# Altium project PoE_Injector_DownloadStation.PrjPcb (part 2 of 2)

## Sheet Mains.SchDoc
size A3; SheetNumber: 2; SheetTotal: 9
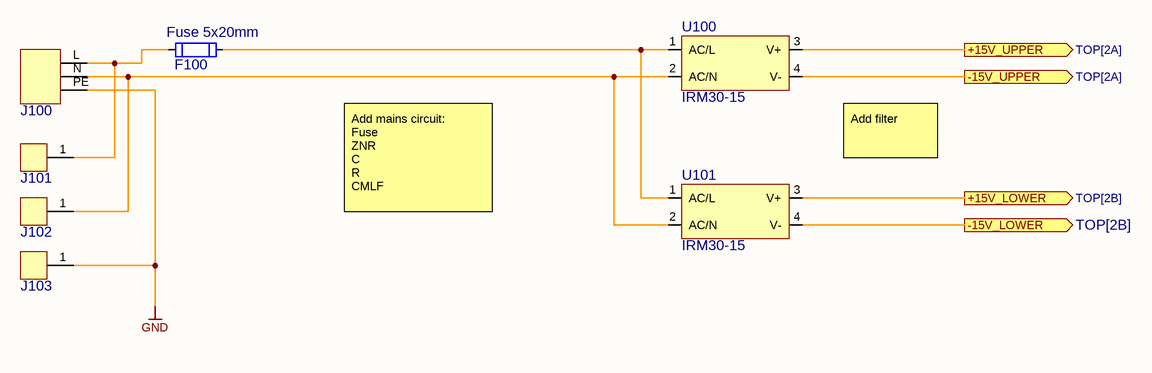
[diagram p5: Mains.SchDoc]

### Parts
F100  Fuse 5x20mm  [OGN_THR]
J100  GSP1.9203.1  [GSP1.9203.1]  (value not drawn)
J101  6.35mmx0.81mm Tab THT  [Tab_THT_635]  (value not drawn)
J102  6.35mmx0.81mm Tab THT  [Tab_THT_635]  (value not drawn)
J103  6.35mmx0.81mm Tab THT  [Tab_THT_635]  (value not drawn)
U100  IRM30-15  [IRM30]
U101  IRM30-15  [IRM30]

### Ports
+15V_LOWER (out, see TOP[2B]), +15V_UPPER (out, see TOP[2A]), -15V_LOWER (out, see TOP[2B]), -15V_UPPER (out, see TOP[2A])

### Nets
GND: J100.PE J103.1 U101.4(V-) ; port -15V_LOWER
GND_BAT: U100.4(V-) ; port -15V_UPPER
NetF100_1: F100.1 J100.L J101.1
NetF100_2: F100.2 U100.1(AC/L) U101.1(AC/L)
NetJ100_N: J100.N J102.1 U100.2(AC/N) U101.2(AC/N)
NetQ200_Charger_Lower_D: U101.3(V+) ; port +15V_LOWER
NetQ200_Charger_Upper_D: U100.3(V+) ; port +15V_UPPER

### Notes on the sheet
- Add filter
- Add mains circuit:
  Fuse
  ZNR
  C
  R
  CMLF
- Date:
- Size:
- A3
- Schema:
- Layout:

### Library data of the parts
F100 = Fuse/5x20mm/OGN: open fuse holder, 5 x 20 mm, THR, IEC 60335-1; Manufacturer: Schurter; Manufacturer Part Number 1: 3-132-873; Part Number: Fuse/5x20mm/OGN; Package: 5X20; HelpURL: https://www.schurter.com/en/datasheet/typ_OGN.pdf; Manufacturer 1: Schurter; Supplier 1: Digi-Key; Supplier Part Number 1: 486-3-132-873-ND
J100 = GSP1.9203.1: IEC Gerätestecker C14 oder C18, Schraubmontage, rückseitig, PCB-Anschlüsse; Manufacturer: Schurter; Part Number: GSP1.9203.1; HelpURL: https://www.schurter.com/de/datasheet/GSP1; Manufacturer 1: Schurter; Manufacturer Part Number 1: GSP1.9203.1; Supplier 1: Digi-Key; Supplier Part Number 1: 486-4820-ND
J101-J103 = Tab_025_THT: CONN QC TAB 0.250 SOLDER; Manufacturer: GENERIC; Manufacturer 1: TE Connectivity AMP Connectors; Manufacturer Part Number 1: 1217861-1; Part Number: Tab_025_THT; HelpURL: https://www.te.com/usa-en/product-1217861-1.datasheet.pdf; Supplier 1: Digi-Key; Supplier Part Number 1: A100452CT-ND; Manufacturer 3: TE Connectivity; Manufacturer Part Number 3: 1217861-1; Supplier 3: LCSC; Supplier Part Number 3: C428480
U100 U101 = IRM30-15: 30W AC-DC PCB-Mount Green Power Module; Part Number: IRM30-15; Package: Module; HelpURL: https://www.meanwell-web.com/content/files/pdfs/productPdfs/MW/IRM-30/IRM-30-spec.pdf

## Sheet Ethernet_Connector.SchDoc
size A3; SheetNumber: 6; SheetTotal: 9
Used 4 times, as channels Ethernet Channel 1, Ethernet Channel 2, Ethernet Channel 3, Ethernet Channel 4. Parts and nets are listed once, with the designators drawn on the sheet.
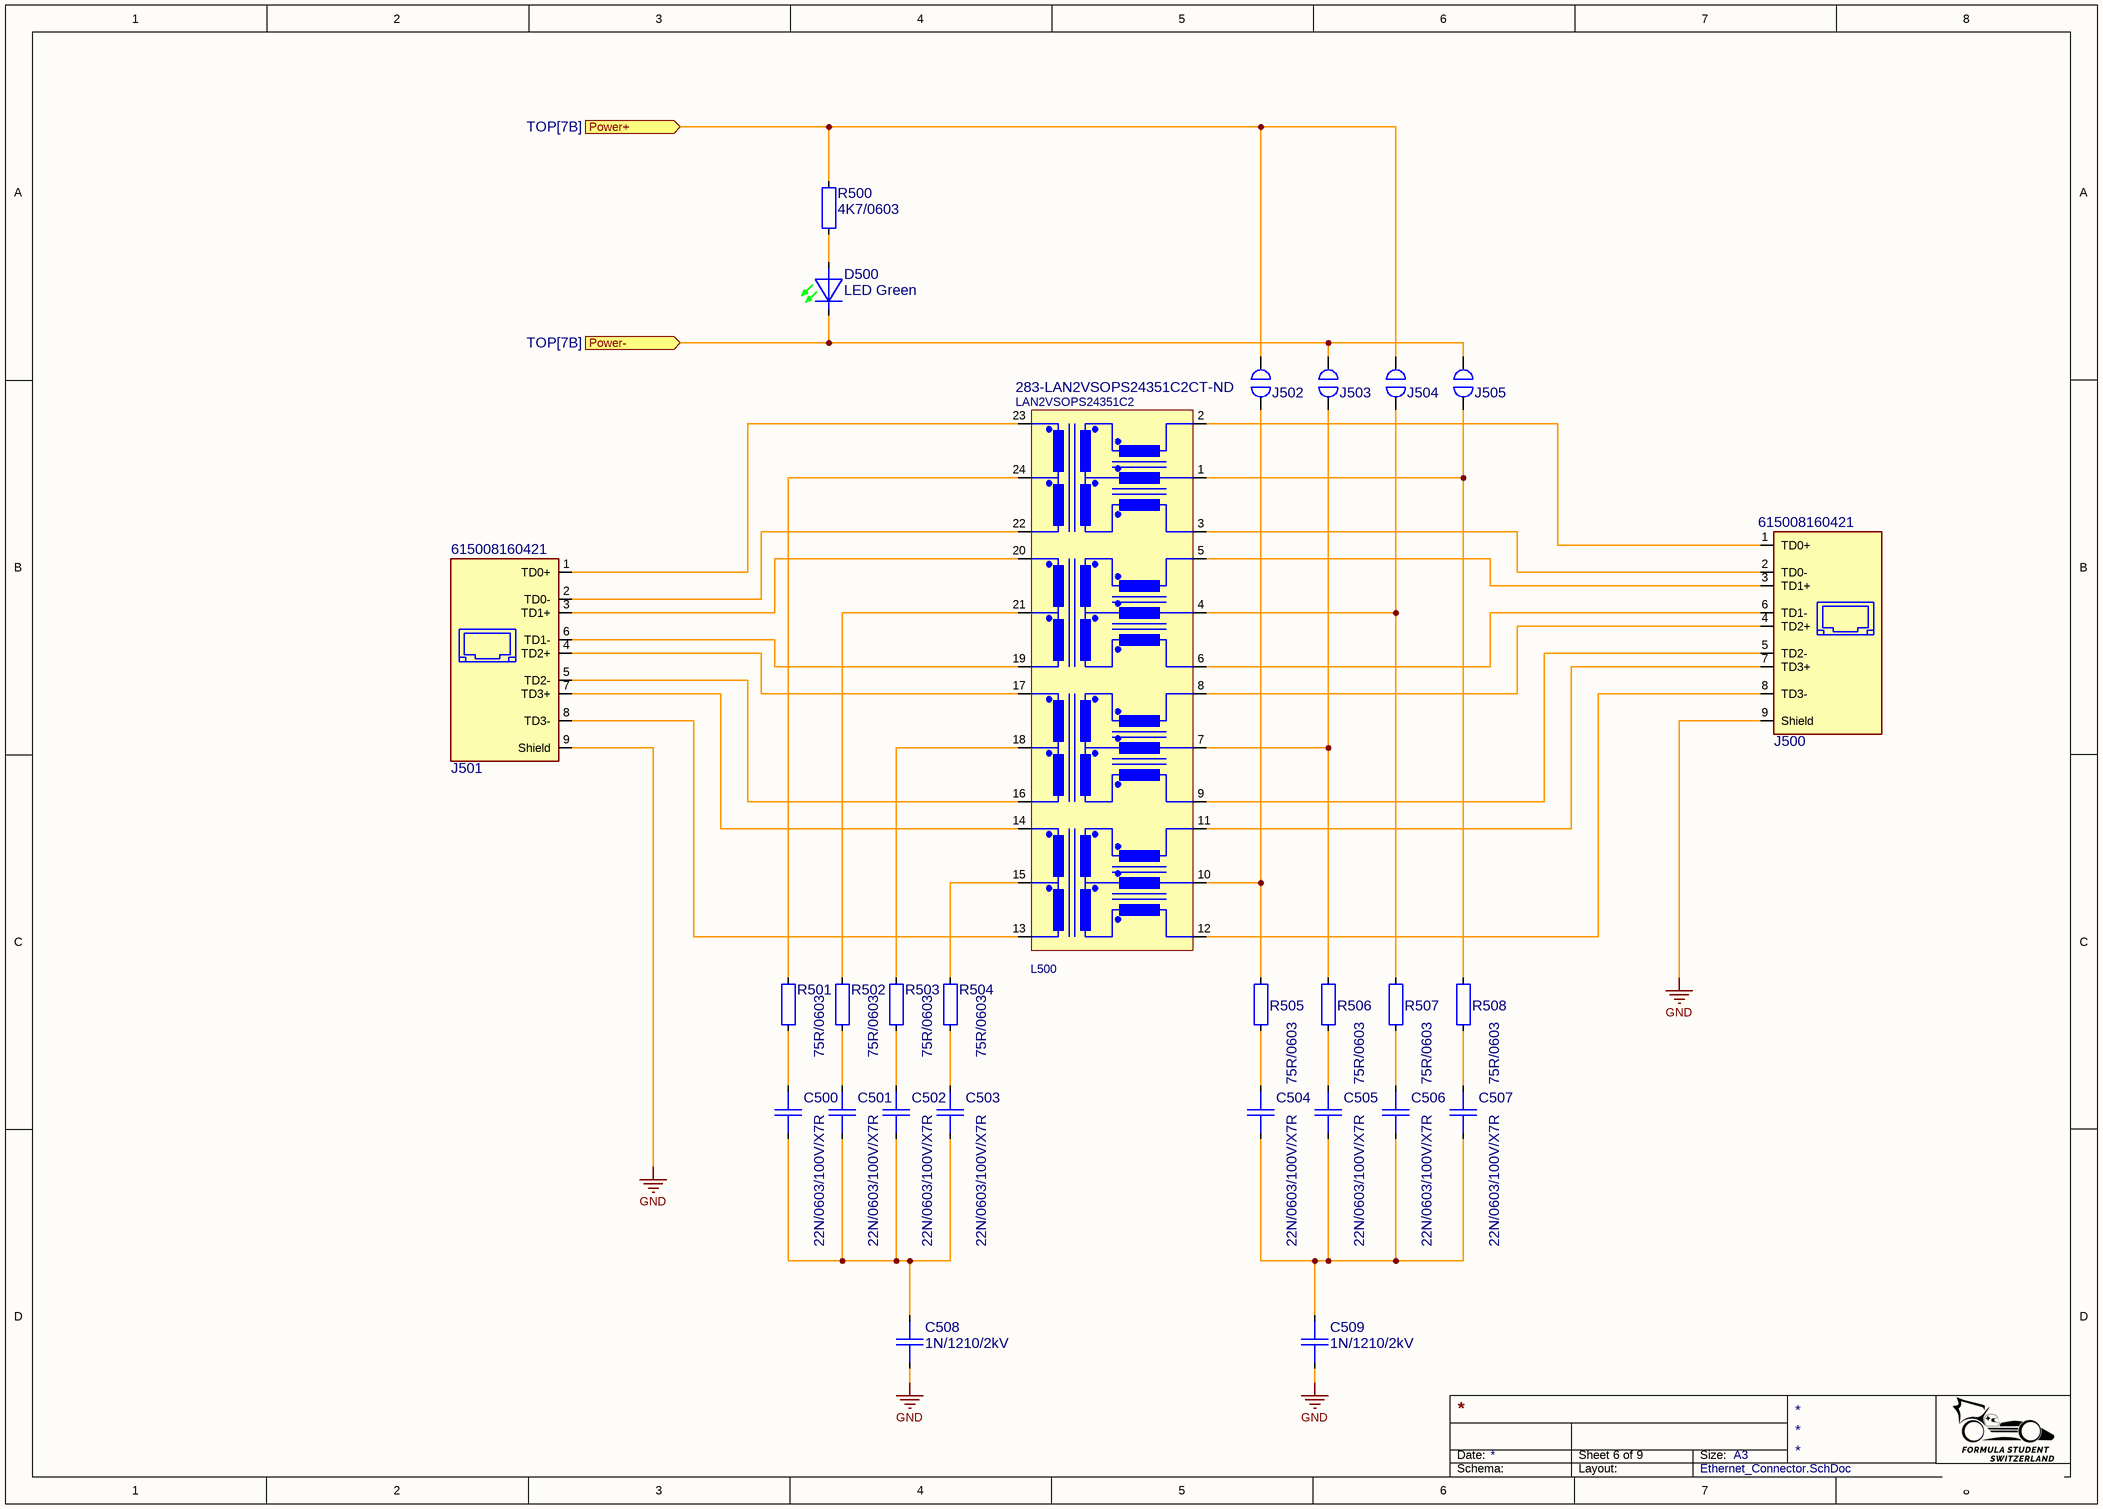
[diagram p6: Ethernet_Connector.SchDoc]

### Parts
C500  22N/0603/100V/X7R  [CAP0603_X7R]
C501  22N/0603/100V/X7R  [CAP0603_X7R]
C502  22N/0603/100V/X7R  [CAP0603_X7R]
C503  22N/0603/100V/X7R  [CAP0603_X7R]
C504  22N/0603/100V/X7R  [CAP0603_X7R]
C505  22N/0603/100V/X7R  [CAP0603_X7R]
C506  22N/0603/100V/X7R  [CAP0603_X7R]
C507  22N/0603/100V/X7R  [CAP0603_X7R]
C508  1N/1210/2kV  [CAP1210_X7R]
C509  1N/1210/2kV  [CAP1210_X7R]
D500  LED Green  [LED0603_GREEN]
J500  615008160421  [ETH_615008160421]
J501  615008160421  [ETH_615008160421]
J502  Solder Jumper 2pin 0.2mm small  [Solder_Jumper_2pin_0.2mm_small]  (value not drawn)
J503  Solder Jumper 2pin 0.2mm small  [Solder_Jumper_2pin_0.2mm_small]  (value not drawn)
J504  Solder Jumper 2pin 0.2mm small  [Solder_Jumper_2pin_0.2mm_small]  (value not drawn)
J505  Solder Jumper 2pin 0.2mm small  [Solder_Jumper_2pin_0.2mm_small]  (value not drawn)
L500  LAN2VSOPS24351C2  Supplier Part Number 1: 283-LAN2VSOPS24351C2CT-ND  [IND127P1600X620-24]
R500  4K7/0603  [R0603-0.40-WW]
R501  75R/0603  [R0603-0.40-WW]
R502  75R/0603  [R0603-0.40-WW]
R503  75R/0603  [R0603-0.40-WW]
R504  75R/0603  [R0603-0.40-WW]
R505  75R/0603  [R0603-0.40-WW]
R506  75R/0603  [R0603-0.40-WW]
R507  75R/0603  [R0603-0.40-WW]
R508  75R/0603  [R0603-0.40-WW]

### Ports
Power+ (in, see TOP[7B]), Power- (in, see TOP[7B])

### Nets
GND: C508.2 C509.2 J500.9(Shield) J501.9(Shield)
Power+: J502.1 J504.1 R500.2 ; port Power+
Power-: D500.1 J503.1 J505.1 ; port Power-
NetC500_1: C500.1 R501.2
NetC500_2: C500.2 C501.2 C502.2 C503.2 C508.1
NetC501_1: C501.1 R502.2
NetC502_1: C502.1 R503.2
NetC503_1: C503.1 R504.2
NetC504_1: C504.1 R505.2
NetC504_2: C504.2 C505.2 C506.2 C507.2 C509.1
NetC505_1: C505.1 R506.2
NetC506_1: C506.1 R507.2
NetC507_1: C507.1 R508.2
NetD500_2: D500.2 R500.1
NetJ500_1: J500.1(TD0+) L500.2
NetJ500_2: J500.2(TD0-) L500.3
NetJ500_3: J500.3(TD1+) L500.5
NetJ500_4: J500.4(TD2+) L500.8
NetJ500_5: J500.5(TD2-) L500.9
NetJ500_6: J500.6(TD1-) L500.6
NetJ500_7: J500.7(TD3+) L500.11
NetJ500_8: J500.8(TD3-) L500.12
NetJ501_1: J501.1(TD0+) L500.23
NetJ501_2: J501.2(TD0-) L500.22
NetJ501_3: J501.3(TD1+) L500.20
NetJ501_4: J501.4(TD2+) L500.17
NetJ501_5: J501.5(TD2-) L500.16
NetJ501_6: J501.6(TD1-) L500.19
NetJ501_7: J501.7(TD3+) L500.14
NetJ501_8: J501.8(TD3-) L500.13
NetJ502_2: J502.2 L500.10 R505.1
NetJ503_2: J503.2 L500.7 R506.1
NetJ504_2: J504.2 L500.4 R507.1
NetJ505_2: J505.2 L500.1 R508.1
NetL500_15: L500.15 R504.1
NetL500_18: L500.18 R503.1
NetL500_21: L500.21 R502.1
NetL500_24: L500.24 R501.1

### Channels
Ethernet Channel 1: designators end in _Ethernet_Channel_1; ports Power+=48V Power-=NetC402_2
Ethernet Channel 2: designators end in _Ethernet_Channel_2; ports Power+=48V Power-=NetC403_2
Ethernet Channel 3: designators end in _Ethernet_Channel_3; ports Power+=48V Power-=NetC405_2
Ethernet Channel 4: designators end in _Ethernet_Channel_4; ports Power+=48V Power-=NetC406_2

### Notes on the sheet
- Date:
- Size:
- A3
- Schema:
- Layout:

### Library data of the parts
C500-C507 = 22N/0603/100V/X7R: CAP SM 0603 22nF 100V X7R; Manufacturer: GENERIC; Manufacturer 1: KEMET; Manufacturer Part Number 1: C0603C223K1RAC7867; Absolute Value: 2.2E-8; Eurocircuits GPN: GPC0603223-100; Part Number: 22N/0603/100V/X7R; Package: 0603; Value: 22nF; HelpURL: https://connect.kemet.com:7667/gateway/IntelliData-ComponentDocumentation/1.0/download/datasheet/C0603C223K1RACTU; Supplier 1: Digi-Key; Supplier Part Number 1: 399-C0603C223K1RAC7867CT-ND; Manufacturer Part Number 3: 0603B223K101CT; Supplier 3: LCSC; Supplier Part Number 3: C388010
C508 C509 = 1N/1210/2kV: CAP SM 1210 1nF 2kV; Manufacturer: GENERIC; Manufacturer 1: Holy Stone Enterprise Co., Ltd.; Manufacturer Part Number 1: C1210X102K202T; Value: 1N; Absolute Value: 1E-9; Part Number: 1N/1210/2kV; Package: 1210; HelpURL: https://www.holystone.com.tw/downloads/series/10000/1000/45/20220530174254_file1.pdf; Supplier 1: Digi-Key; Supplier Part Number 1: 4587-C1210X102K202TCT-ND; Manufacturer Part Number 3: 1210B102K202NT; Supplier 3: LCSC; Supplier Part Number 3: C2836780
D500 = LED Green 0603: Generic LED Green 0603; Manufacturer 1: Würth; Manufacturer Part Number 1: 150060VS75000; Part Number: LED Green 0603; Manufacturer: GENERIC; Package: 603; Value: Green; Absolute Value: Green; HelpURL: https://www.we-online.com/katalog/datasheet/150060VS75000.pdf; Supplier 1: Digi-Key; Supplier Part Number 1: 732-4980-1-ND; Manufacturer 3: Everlight Elec; Manufacturer Part Number 3: 19-217/GHC-YR1S2/3T; Supplier 3: LCSC; Supplier Part Number 3: C72043; JLC Type: Basic
J500 J501 = ETH_THT_Vert_Schielded: CONN MOD JACK 8P8C VERT SHIELDED; Manufacturer: GENERIC; Manufacturer 1: Würth; Previous Identity: RJ45 Buchse, Gigabit Ethernet; Package Type: HALO/PBL HFJ11-1G41E-L12RL; Part Number: ETH_THT_Vert_Schielded; HelpURL: https://www.we-online.com/components/products/datasheet/615008160421.pdf; Manufacturer Part Number 1: 615008160421; Supplier 1: Digi-Key; Supplier Part Number 1: 732-615008160421-ND; Manufacturer 3: HCTL; Manufacturer Part Number 3: HC-RJ45-5224-1-4; Supplier 3: LCSC; Supplier Part Number 3: C3010560
J502-J505 = Solder_Jumper_2pin_0.2mm_small: Solder jumper with two pins with a spacing of 0.2mm; Manufacturer: NONE; Part Number: Solder_Jumper_2pin_0.2mm_small
L500 = LAN2VSOPS24351C2: 350µH LAN 1000 Base-T, Power over Ethernet (PoE) Pulswandler 1CT:1CT Oberflächenmontage; Manufacturer: Eaton; Part Number: LAN2VSOPS24351C2; HelpURL: https://www.eaton.com/content/dam/eaton/products/electronic-components/resources/data-sheet/eaton-lan2vsop-1000-base-t-lan-transformer-poe-data-sheet-elx1376-en.pdf; Manufacturer 1: Eaton; Manufacturer Part Number 1: LAN2VSOPS24351C2; Manufacturer 3: CND-tek; Manufacturer Part Number 3: G2412S; Supplier 3: LCSC; Supplier Part Number 3: C2912224; Supplier 1: DigiKey
R500 = 4K7/0603: RES SM 0603 4K7; Manufacturer: GENERIC; Manufacturer 1: YAGEO; Manufacturer Part Number 1: RC0603FR-134K7L; Absolute Value: 4700; Eurocircuits GPN: GPR06034K7; Part Number: 4K7/0603; Package: 0603; Value: 4K7; HelpURL: https://www.yageo.com/upload/media/product/app/datasheet/rchip/pyu-rc_group_51_rohs_l.pdf; Supplier 1: Digi-Key; Supplier Part Number 1: 13-RC0603FR-134K7LCT-ND; Manufacturer 2: YAGEO; Manufacturer Part Number 2: RC0603FR-104K7L; Supplier 2: Digi-Key; Supplier Part Number 2: 13-RC0603FR-104K7LCT-ND; Manufacturer 3: UNI-ROYAL(Uniroyal Elec); Manufacturer Part Number 3: 0603WAF4701T5E; Supplier 3: LCSC; Supplier Part Number 3: C23162; JLC Type: Basic
R501-R508 = 75R/0603: RES SM 0603 75R; Manufacturer: GENERIC; Manufacturer 1: YAGEO; Manufacturer Part Number 1: RC0603FR-1375RL; Absolute Value: 75; Eurocircuits GPN: GPR060375R; Part Number: 75R/0603; Package: 0603; Value: 75R; HelpURL: https://www.yageo.com/upload/media/product/productsearch/datasheet/rchip/PYu-RC_Group_51_RoHS_L_12.pdf; Supplier 1: Digi-Key; Supplier Part Number 1: 13-RC0603FR-1375RLCT-ND; Manufacturer 2: YAGEO; Manufacturer Part Number 2: RC0603FR-1075RL; Supplier 2: Digi-Key; Supplier Part Number 2: 13-RC0603FR-1075RLCT-ND; Supplier 3: LCSC; Supplier Part Number 3: C112309

## Sheet Interfaces.SchDoc
size A3; SheetNumber: 7; SheetTotal: 9
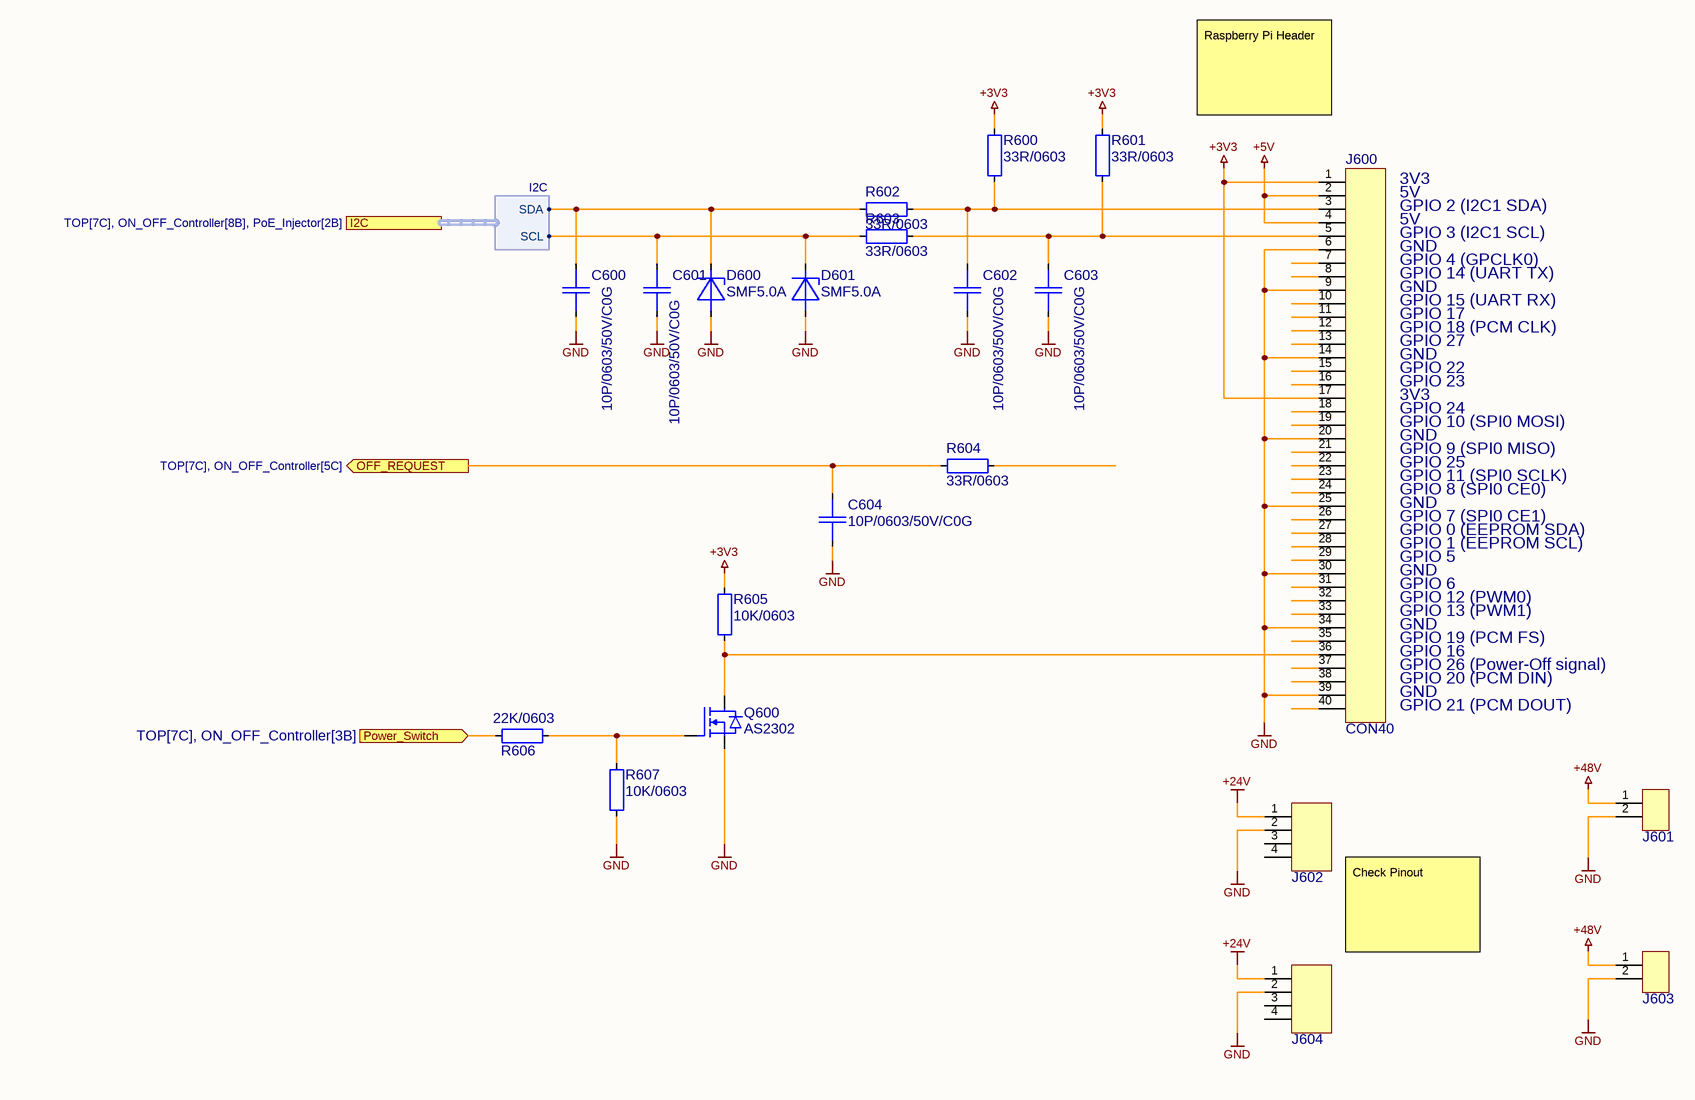
[diagram p7: Interfaces.SchDoc]

### Parts
C600  10P/0603/50V/C0G  [CAP0603_C0G]
C601  10P/0603/50V/C0G  [CAP0603_C0G]
C602  10P/0603/50V/C0G  [CAP0603_C0G]
C603  10P/0603/50V/C0G  [CAP0603_C0G]
C604  10P/0603/50V/C0G  [CAP0603_C0G]
D600  SMF5.0A  [SOD3720X110]
D601  SMF5.0A  [SOD3720X110]
J600  CON40  [HEAD_254_2X20]
J601  430450212  [430450212]  (value not drawn)
J602  430450412  [430450412]  (value not drawn)
J603  430450212  [430450212]  (value not drawn)
J604  430450412  [430450412]  (value not drawn)
Q600  AS2302  [SOT2395P280X125-3-SE]
R600  33R/0603  [R0603-0.40-WW]
R601  33R/0603  [R0603-0.40-WW]
R602  33R/0603  [R0603-0.40-WW]
R603  33R/0603  [R0603-0.40-WW]
R604  33R/0603  [R0603-0.40-WW]
R605  10K/0603  [R0603-0.40-WW]
R606  22K/0603  [R0603-0.40-WW]
R607  10K/0603  [R0603-0.40-WW]

### Ports
I2C (harness I2C, see TOP[7C], ON_OFF_Controller[8B], PoE_Injector[2B]), OFF_REQUEST (out, see TOP[7C], ON_OFF_Controller[5C]), Power_Switch (in, see TOP[7C], ON_OFF_Controller[3B])

### Harnesses
I2C: SDA, SCL

### Nets
+3V3: J600.1 J600.17 R600.2 R601.2 R605.1
+5V: J600.2 J600.4
+24V: J602.1 J604.1
+48V: J601.1 J603.1
GND: C600.2 C601.2 C602.2 C603.2 C604.2 D600.2 D601.2 J600.6 J600.9 J600.14 J600.20 J600.25 J600.30 J600.34 J600.39 J601.2 J602.2 J603.2 J604.2 Q600.2(SOURCE) R607.2
I2C.SCL: C601.1 D601.1 R603.1 ; port I2C.SCL
I2C.SDA: C600.1 D600.1 R602.1 ; port I2C.SDA
NetC602_1: C602.1 J600.3 R600.1 R602.2
NetC603_1: C603.1 J600.5 R601.1 R603.2
NetC604_1: C604.1 R604.1 ; port OFF_REQUEST
NetD800_2: R606.1 ; port Power_Switch
NetJ600_36: J600.36 Q600.3(DRAIN) R605.2
NetQ600_1: Q600.1(GATE) R606.2 R607.1

Not connected (* = marked no-connect by the designer): J600 7 8 10 11 12 13 15 16 18 19 21 22 23 24 26 27 28 29 31 32 33 35 37 38 40; J602 3 4; J604 3 4; R604 2

### Notes on the sheet
- Raspberry Pi Header
- 3V3
- 5V
- GPIO 2 (I2C1 SDA)
- GPIO 3 (I2C1 SCL)
- GND
- GPIO 4 (GPCLK0)
- GPIO 14 (UART TX)
- GPIO 15 (UART RX)
- GPIO 17
- GPIO 18 (PCM CLK)
- GPIO 27
- GPIO 22
- GPIO 23
- GPIO 24
- GPIO 10 (SPI0 MOSI)
- GPIO 9 (SPI0 MISO)
- GPIO 25
- GPIO 11 (SPI0 SCLK)
- GPIO 8 (SPI0 CE0)
- GPIO 7 (SPI0 CE1)
- GPIO 0 (EEPROM SDA)
- GPIO 1 (EEPROM SCL)
- GPIO 5
- GPIO 6
- GPIO 12 (PWM0)
- GPIO 13 (PWM1)
- GPIO 19 (PCM FS)
- GPIO 16
- GPIO 26 (Power-Off signal)
- GPIO 20 (PCM DIN)
- GPIO 21 (PCM DOUT)
- Check Pinout
- Date:
- Size:
- A3
- Schema:
- Layout:

### Library data of the parts
C600-C604 = 10P/0603/50V/C0G: CAP SM 0603 10pF 50V C0G; Manufacturer: GENERIC; Manufacturer 1: YAGEO; Manufacturer Part Number 1: CC0603JRNPO9BN100; Absolute Value: 1E-11; Eurocircuits GPN: GPC0603100-C0G; Part Number: 10P/0603/50V/C0G; Package: 0603; Value: 10pF; HelpURL: https://www.yageo.com/upload/media/product/productsearch/datasheet/mlcc/UPY-GP_NP0_16V-to-50V_18.pdf; Supplier 1: Digi-Key; Supplier Part Number 1: 311-1058-1-ND; Manufacturer 2: YAGEO; Manufacturer Part Number 2: CC0603KRNPO9BN100; Supplier 2: Digi-Key; Supplier Part Number 2: 311-4025-1-ND
D600 D601 = SMF5.0A: TVS DIODE 5VWM 9.2VC SOD123F; Manufacturer: Littelfuse Inc.; Manufacturer Part Number 1: SMF5.0A-T13; Absolute Value: 5V; Part Number: SMF5.0A; Package: SOD-123F; Value: SMF5.0A; HelpURL: https://www.littelfuse.com/~/media/electronics/datasheets/tvs_diodes/littelfuse_tvs_diode_smf_datasheet.pdf.pdf; Manufacturer 1: Littelfuse Inc.; Supplier 1: Digi-Key; Supplier Part Number 1: 18-SMF5.0A-T13CT-ND; Manufacturer 2: Littelfuse Inc.; Manufacturer Part Number 2: SMF5.0A; Supplier 2: Digi-Key; Supplier Part Number 2: F5748CT-ND; Manufacturer 3: MDD（Microdiode Electronics）; Manufacturer Part Number 3: SMF5.0A; Supplier 3: LCSC; Supplier Part Number 3: C193402; JLC Type: Extended
J600 = Header_2x20: Header 100 mil; Manufacturer: GENERIC; Part Number: Header_2x20
J601 J603 = Microfit_3.0_1x2_VERT_THT: Micro-Fit 3.0 Vertical Header, 3.00mm Pitch, Dual Row, 2 Circuits, with PCB Polarizing Peg, Tin, Glow-Wire Capable, Black; Manufacturer 1: Molex; Part Number: Microfit_3.0_1x2_VERT_THT; HelpURL: https://tools.molex.com/pdm_docs/ps/PS-43045.pdf; Manufacturer Part Number 1: 430450212; Supplier 1: Digi-Key; Supplier Part Number 1: WM1789-ND
J602 J604 = Microfit_3.0_2x2_VERT_THT: Micro-Fit 3.0 Vertical Header, 3.00mm Pitch, Dual Row, 4 Circuits, with PCB Polarizing Peg, Tin, Glow-Wire Capable, Black; Manufacturer 1: Molex; Part Number: Microfit_3.0_2x2_VERT_THT; HelpURL: https://tools.molex.com/pdm_docs/sd/430450412_sd.pdf; Manufacturer Part Number 1: 430450412; Supplier 1: Digi-Key; Supplier Part Number 1: WM1790-ND
Q600 = AS2302: N-Channel 20V(D-S) MOSFET; Manufacturer: GENERIC; Manufacturer 1: ANBON SEMICONDUCTOR (INT'L) LIMITED; Part Number: AS2302; Package: SOT23; HelpURL: https://datasheet.lcsc.com/lcsc/1809211431_AnBon-AS2302_C232266.pdf; Manufacturer Part Number 1: AS2302; Supplier 1: Digi-Key; Supplier Part Number 1: 4530-AS2302CT-ND; Manufacturer 3: AnBon; Manufacturer Part Number 3: AS2302; Supplier 3: LCSC; Supplier Part Number 3: C232266; JLC Type: Extended
R600-R604 = 33R/0603: RES SM 0603 33R; Manufacturer: GENERIC; Manufacturer 1: YAGEO; Manufacturer Part Number 1: RC0603FR-1333RL; Absolute Value: 33; Eurocircuits GPN: GPR060333R; Part Number: 33R/0603; Package: 0603; Value: 33R; HelpURL: https://www.yageo.com/upload/media/product/app/datasheet/rchip/pyu-rc_group_51_rohs_l.pdf; Supplier 1: Digi-Key; Supplier Part Number 1: 13-RC0603FR-1333RLCT-ND; Manufacturer 2: YAGEO; Manufacturer Part Number 2: RC0603FR-1033RL; Supplier 2: Digi-Key; Supplier Part Number 2: 13-RC0603FR-1033RLCT-ND
R605 R607 = 10K/0603: RES SM 0603 10K; Manufacturer: GENERIC; Manufacturer 1: YAGEO; Manufacturer Part Number 1: RC0603FR-1310KL; Absolute Value: 10000; Eurocircuits GPN: GPR060310K; Part Number: 10K/0603; Package: 0603; Value: 10K; HelpURL: https://www.yageo.com/upload/media/product/productsearch/datasheet/rchip/PYu-RC_Group_51_RoHS_L_12.pdf; Supplier 1: Digi-Key; Supplier Part Number 1: 13-RC0603FR-1310KLCT-ND; Manufacturer 2: YAGEO; Manufacturer Part Number 2: RC0603FR-1010KL; Supplier 2: Digi-Key; Supplier Part Number 2: 13-RC0603FR-1010KLCT-ND; Manufacturer 3: UNI-ROYAL(Uniroyal Elec); Manufacturer Part Number 3: 0603WAF1002T5E; Supplier 3: LCSC; Supplier Part Number 3: C25804; JLC Type: Basic
R606 = 22K/0603: RES SM 0603 22K; Manufacturer: GENERIC; Manufacturer 1: YAGEO; Manufacturer Part Number 1: RC0603FR-1322KL; Absolute Value: 22000; Eurocircuits GPN: GPR060322K; Part Number: 22K/0603; Package: 0603; Value: 22K; HelpURL: https://www.yageo.com/upload/media/product/app/datasheet/rchip/pyu-rc_group_51_rohs_l.pdf; Supplier 1: Digi-Key; Supplier Part Number 1: 13-RC0603FR-1322KLCT-ND; Manufacturer 2: YAGEO; Manufacturer Part Number 2: RC0603FR-1022KL; Supplier 2: Digi-Key; Supplier Part Number 2: 13-RC0603FR-1022KLCT-ND; Manufacturer 3: UNI-ROYAL(Uniroyal Elec); Manufacturer Part Number 3: 0603WAF2202T5E; Supplier 3: LCSC; Supplier Part Number 3: C31850; JLC Type: Basic

## Sheet RPI_Supply.SchDoc: RPI Supply
size A3; SheetNumber: 8; SheetTotal: 9
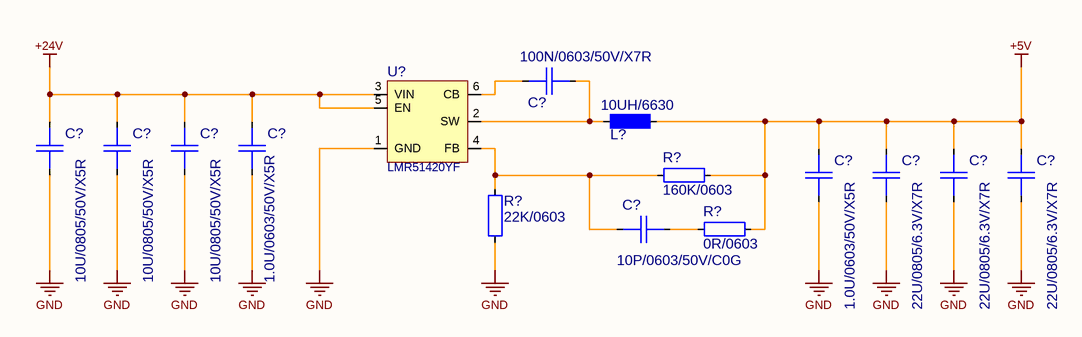
[diagram p8: RPI_Supply.SchDoc]

### Parts
(Parts that share a designator on the sheet are numbered #1, #2 ... from top to bottom, then left to right.)
C?#1  100N/0603/50V/X7R  [CAP0603_X7R]
C?#2  10U/0805/50V/X5R  [CAP0805_X7R]
C?#3  10U/0805/50V/X5R  [CAP0805_X7R]
C?#4  10U/0805/50V/X5R  [CAP0805_X7R]
C?#5  1.0U/0603/50V/X5R  [CAP0603_X7R]
C?#6  1.0U/0603/50V/X5R  [CAP0603_X7R]
C?#7  22U/0805/6.3V/X7R  [CAP0805_X7R]
C?#8  22U/0805/6.3V/X7R  [CAP0805_X7R]
C?#9  22U/0805/6.3V/X7R  [CAP0805_X7R]
C?#10  10P/0603/50V/C0G  [CAP0603_C0G]
L?  10UH/6630  [INDM660730X30]
R?#1  160K/0603  [R0603-0.40-WW]
R?#2  0R/0603  [R0603-0.40-WW]
R?#3  22K/0603  [R0603-0.40-WW]
U?  LMR51420YF  [SOT2395P280X125-6-NW]

### Nets
+5V: C?#6.1 C?#7.1 C?#8.1 C?#9.1 L?.2 R?#1.1 R?#2.2
+24V: C?#2.1 C?#3.1 C?#4.1 C?#5.1 U?.3(VIN) U?.5(EN)
GND: C?#2.2 C?#3.2 C?#4.2 C?#5.2 C?#6.2 C?#7.2 C?#8.2 C?#9.2 R?#3.1 U?.1(GND)
NetC?#1_1: C?#1.1 U?.6(CB)
NetC?#1_2: C?#1.2 L?.1 U?.2(SW)
NetC?#10_1: C?#10.1 R?#1.2 R?#3.2 U?.4(FB)
NetC?#10_2: C?#10.2 R?#2.1

### Notes on the sheet
- Date:
- Size:
- A3
- Schema:
- Layout:

### Library data of the parts
C?#1 = 100N/0603/50V/X7R: CAP SM 0603 100nF 50V X7R; Manufacturer: GENERIC; Manufacturer 1: YAGEO; Manufacturer Part Number 1: CC0603KPX7R9BB104; Absolute Value: 1E-7; Eurocircuits GPN: GPC0603104; Part Number: 100N/0603/50V/X7R; Package: 0603; Value: 100nF; HelpURL: https://www.yageo.com/upload/media/product/app/datasheet/mlcc/upy-gphc_x7r_6_3v-to-250v.pdf; Supplier 1: Digi-Key; Supplier Part Number 1: 311-3567-1-ND; Manufacturer 2: YAGEO; Manufacturer Part Number 2: CC0603MRX7R9BB104; Supplier 2: Digi-Key; Supplier Part Number 2: 311-4110-1-ND; Supplier 3: LCSC; Supplier Part Number 3: C14663; JLC Type: Basic
C?#2-C?#4 = 10U/0805/50V/X5R: CAP SM 0805 10uF 50V X5R; Manufacturer: GENERIC; Manufacturer 1: Murata Electronics; Manufacturer Part Number 1: GRM21BR61H106KE43K; Absolute Value: 1E-5; Eurocircuits GPN: GPN0805106-50-X5R; Part Number: 10U/0805/50V/X5R; Package: 0805; Value: 10uF; HelpURL: https://search.murata.co.jp/Ceramy/image/img/A01X/G101/ENG/GRM21BR61H106KE43-01A.pdf; Supplier 1: Digi-Key; Supplier Part Number 1: 490-GRM21BR61H106KE43KCT-ND; Manufacturer Part Number 3: GRM21BR61H106KE43L; Supplier 3: LCSC; Supplier Part Number 3: C440198; JLC Type: Basic
C?#5 C?#6 = 1.0U/0603/50V/X5R: CAP SM 0603 1.0uF 50V X5R; Manufacturer: GENERIC; Manufacturer 1: Samsung Electro-Mechanics; Manufacturer Part Number 1: CL10A105KB8NNNC; Absolute Value: 1E-6; Eurocircuits GPN: GPC0603105-X5R; Part Number: 1.0U/0603/50V/X5R; Package: 0603; Value: 1.0uF; HelpURL: https://mm.digikey.com/Volume0/opasdata/d220001/medias/docus/658/CL10A105KB8NNNC_Spec.pdf; Supplier 1: Digi-Key; Supplier Part Number 1: 1276-1860-1-ND; Manufacturer Part Number 3: CL10A105KB8NNNC; Supplier 3: LCSC; Supplier Part Number 3: C15849; JLC Type: Basic
C?#7-C?#9 = 22U/0805/6.3V/X7R: CAP SM 0805 22uF 6.3V X7R; Manufacturer: GENERIC; Manufacturer 1: Murata; Manufacturer Part Number 1: GRM21BZ71A226ME15L; Absolute Value: 2.2E-5; Eurocircuits GPN: GPN0805226-6.3; Part Number: 22U/0805/6.3V/X7R; Package: 0805; Value: 22uF; HelpURL: https://search.murata.co.jp/Ceramy/image/img/A01X/G101/ENG/GRM21BZ71A226ME15-01.pdf; Supplier 1: Digi-Key; Supplier Part Number 1: 490-GRM21BZ71A226ME15LCT-ND; Manufacturer 2: Murata; Manufacturer Part Number 2: GRM21BZ70J226ME44L; Supplier 2: Digi-Key; Supplier Part Number 2: 490-GRM21BZ70J226ME44LCT-ND
C?#10 = 10P/0603/50V/C0G: as C600 on sheet Interfaces; Part Number: 10P/0603/50V/C0G; Package: 0603; Value: 10pF; HelpURL: https://www.yageo.com/upload/media/product/productsearch/datasheet/mlcc/UPY-GP_NP0_16V-to-50V_18.pdf; Supplier 1: Digi-Key; Supplier Part Number 1: 311-1058-1-ND; Manufacturer 2: YAGEO; Manufacturer Part Number 2: CC0603KRNPO9BN100; Supplier 2: Digi-Key; Supplier Part Number 2: 311-4025-1-ND
L? = 10UH/6630: FIXED IND 10UH 4A 68 MOHM SMD; Manufacturer: GENERIC; Manufacturer 1: Pulse Electronics; Manufacturer Part Number 1: BMRB00060630100MA1; Absolute Value: 1E-5; Part Number: 10UH/6630; Package: 6030 Inductor; Value: 10UH; HelpURL: https://productfinder.pulseelectronics.com/api/open/part-attachments/datasheet/BMRB00060630100MA1; Supplier 1: Digi-Key; Supplier Part Number 1: 553-BMRB00060630100MA1CT-ND; Manufacturer 3: Chilisin Elec; Manufacturer Part Number 3: BMRB00060630100MA1; Supplier 3: LCSC; Supplier Part Number 3: C5201679
R?#1 = 160K/0603: RES SM 0603 160K; Manufacturer: GENERIC; Manufacturer 1: YAGEO; Manufacturer Part Number 1: RC0603FR-13160KL; Absolute Value: 160000; Eurocircuits GPN: GPR0603160K; Part Number: 160K/0603; Package: 0603; Value: 160K; HelpURL: https://www.yageo.com/upload/media/product/productsearch/datasheet/rchip/PYu-RC_Group_51_RoHS_L_12.pdf; Supplier 1: Digi-Key; Supplier Part Number 1: 13-RC0603FR-13160KLCT-ND; Manufacturer 2: YAGEO; Manufacturer Part Number 2: RC0603FR-07160KL; Supplier 2: Digi-Key; Supplier Part Number 2: 311-160KHRCT-ND
R?#2 = 0R/0603: RES SM 0603 0R; Manufacturer: GENERIC; Manufacturer 1: YAGEO; Manufacturer Part Number 1: RC0603FR-070RL; Absolute Value: 0; Eurocircuits GPN: GPR06030R; Part Number: 0R/0603; Package: 0603; Value: 0R; HelpURL: https://www.yageo.com/upload/media/product/app/datasheet/rchip/pyu-rc_group_51_rohs_l.pdf; Supplier 1: Digi-Key; Supplier Part Number 1: 311-0.0HRCT-ND; Manufacturer 2: YAGEO; Manufacturer Part Number 2: RC0603FR-130RL; Supplier 2: Digi-Key; Supplier Part Number 2: 13-RC0603FR-130RLCT-ND; Manufacturer 3: UNI-ROYAL(Uniroyal Elec); Manufacturer Part Number 3: 0603WAF0000T5E; Supplier 3: LCSC; Supplier Part Number 3: C21189; JLC Type: Basic
R?#3 = 22K/0603: as R606 on sheet Interfaces; Part Number: 22K/0603; Package: 0603; Value: 22K; HelpURL: https://www.yageo.com/upload/media/product/app/datasheet/rchip/pyu-rc_group_51_rohs_l.pdf; Supplier 1: Digi-Key; Supplier Part Number 1: 13-RC0603FR-1322KLCT-ND; Manufacturer 2: YAGEO; Manufacturer Part Number 2: RC0603FR-1022KL; Supplier 2: Digi-Key; Supplier Part Number 2: 13-RC0603FR-1022KLCT-ND; Manufacturer 3: UNI-ROYAL(Uniroyal Elec); Manufacturer Part Number 3: 0603WAF2202T5E; Supplier 3: LCSC; Supplier Part Number 3: C31850; JLC Type: Basic
U? = LMR51420YF: SIMPLE SWITCHER® power converter 4.5-V to 36-V, 2-A, synchronous buck with 40-µA IQ; Manufacturer: Texas Instruments; Manufacturer Part Number 1: LMR51420YFDDCR; Part Number: LMR51420YF; Package: SOIC-8; HelpURL: https://www.ti.com/lit/ds/symlink/lmr51420.pdf; Manufacturer 1: Texas Instruments; Supplier 1: Digi-Key; Supplier Part Number 1: 296-LMR51420YFDDCRCT-ND; Manufacturer 3: Texas Instruments; Manufacturer Part Number 3: LMR51420YFDDCR; Supplier 3: LCSC; Supplier Part Number 3: C7296200

## Sheet ON_OFF_Controller.SchDoc
size A3; SheetNumber: 9; SheetTotal: 9
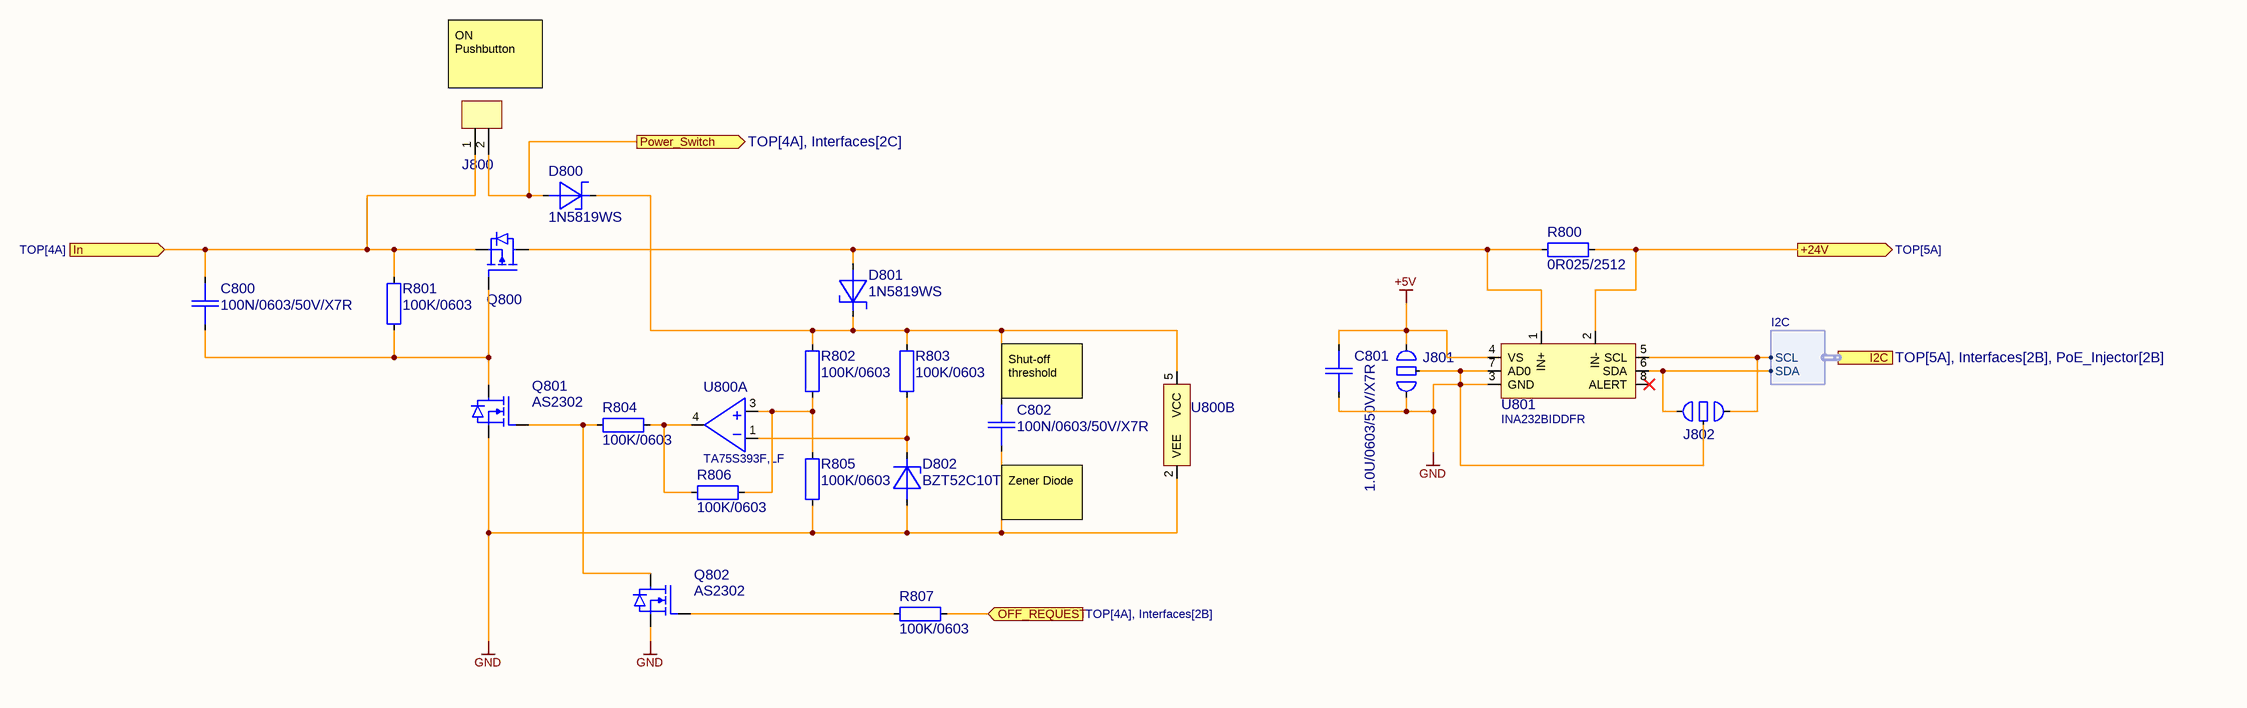
[diagram p9: ON_OFF_Controller.SchDoc]

### Parts
C800  100N/0603/50V/X7R  [CAP0603_X7R]
C801  1.0U/0603/50V/X7R  [CAP0603_X7R]
C802  100N/0603/50V/X7R  [CAP0603_X7R]
D800  1N5819WS  [SOD2513X100]
D801  1N5819WS  [SOD2513X100]
D802  BZT52C10T  [SOD1608X065]
J800  430450212  [430450212]  (value not drawn)
J801  Solder Jumper 3pin 0.2mm  [Solder_Jumper_3pin_0.2mm]  (value not drawn)
J802  Solder Jumper 3pin 0.2mm  [Solder_Jumper_3pin_0.2mm]  (value not drawn)
Q800  MCG35P04-TP  [SON065P330X330X075-5-TH245X175]  (value not drawn)
Q801  AS2302  [SOT2395P280X125-3-SE]
Q802  AS2302  [SOT2395P280X125-3-SE]
R800  0R025/2512  [R2512-0.65-WW]
R801  100K/0603  [R0603-0.40-WW]
R802  100K/0603  [R0603-0.40-WW]
R803  100K/0603  [R0603-0.40-WW]
R804  100K/0603  [R0603-0.40-WW]
R805  100K/0603  [R0603-0.40-WW]
R806  100K/0603  [R0603-0.40-WW]
R807  100K/0603  [R0603-0.40-WW]
U800  TA75S393F,LF  [SOT2395P280X125-5-SW]  (parts A,B of 2)
U801  INA232BIDDFR  [SOT065P280X110-8-SE]

### Ports
+24V (out, see TOP[5A]), I2C (harness I2C, see TOP[5A], Interfaces[2B], PoE_Injector[2B]), In (in, see TOP[4A]), OFF_REQUEST (in, see TOP[4A], Interfaces[2B]), Power_Switch (out, see TOP[4A], Interfaces[2C])

### Harnesses
I2C: SDA, SCL

### Nets
+5V: C801.1 J801.3 U801.4(VS)
+24V: R800.2 U801.2(IN-) ; port +24V
GND: C801.2 C802.2 D802.2 J801.1 J801.2 J802.2 Q801.2(SOURCE) Q802.2(SOURCE) R805.2 U800.2(VEE) U801.3(GND) U801.7(AD0)
I2C.SCL: J802.3 U801.5(SCL) ; port I2C.SCL
I2C.SDA: J802.1 U801.6(SDA) ; port I2C.SDA
NetC200_Charger_Upper_1: C800.1 J800.1 Q800.S(SOURCE) R801.1 ; port In
NetC604_1: R807.1 ; port OFF_REQUEST
NetC800_2: C800.2 Q800.G(GATE) Q801.3(DRAIN) R801.2
NetC802_1: C802.1 D800.1 D801.1 R802.1 R803.1 U800.5(VCC)
NetD800_2: D800.2 J800.2 ; port Power_Switch
NetD801_2: D801.2 Q800.D(DRAIN) R800.1 U801.1(IN+)
NetD802_1: D802.1 R803.2 U800.1(IN-)
NetQ801_1: Q801.1(GATE) Q802.3(DRAIN) R804.1
NetQ802_1: Q802.1(GATE) R807.2
NetR802_2: R802.2 R805.1 R806.1 U800.3(IN+)
NetR804_2: R804.2 R806.2 U800.4(OUT)

Not connected (* = marked no-connect by the designer): U801 8(ALERT)*

### Notes on the sheet
- (near J800) ON Pushbutton
- (near C802) Shut-off threshold
- (near C802) Zener Diode
- Date:
- Size:
- A3
- Schema:
- Layout:

### Library data of the parts
C800 C802 = 100N/0603/50V/X7R: as C?#1 on sheet RPI_Supply; Part Number: 100N/0603/50V/X7R; Package: 0603; Value: 100nF; HelpURL: https://www.yageo.com/upload/media/product/app/datasheet/mlcc/upy-gphc_x7r_6_3v-to-250v.pdf; Supplier 1: Digi-Key; Supplier Part Number 1: 311-3567-1-ND; Manufacturer 2: YAGEO; Manufacturer Part Number 2: CC0603MRX7R9BB104; Supplier 2: Digi-Key; Supplier Part Number 2: 311-4110-1-ND; Supplier 3: LCSC; Supplier Part Number 3: C14663; JLC Type: Basic
C801 = 1.0U/0603/50V/X7R: CAP SM 0603 1.0uF 50V X7R; Manufacturer: GENERIC; Manufacturer 1: YAGEO; Manufacturer Part Number 1: CC0603KRX7R9BB105; Absolute Value: 1E-6; Eurocircuits GPN: GPC0603105; Part Number: 1.0U/0603/50V/X7R; Package: 0603; Value: 1.0uF; HelpURL: https://www.yageo.com/upload/media/product/app/datasheet/mlcc/upy-gphc_x7r_6_3v-to-250v.pdf; Supplier 1: Digi-Key; Supplier Part Number 1: 311-2082-1-ND
D800 D801 = 1N5819WS: 40V 600mV@1A 1A SOD-323 Schottky Barrier Diodes (SBD) ROHS; Manufacturer: GENERIC; Part Number: 1N5819WS; Package: SOD323; Value: 1N5819WS; Absolute Value: 40V; HelpURL: https://datasheet.lcsc.com/lcsc/2204281430_Guangdong-Hottech-1N5819WS_C191023.pdf; Manufacturer 3: Guangdong Hottech; Manufacturer Part Number 3: 1N5819WS; Supplier 3: LCSC; Supplier Part Number 3: C191023; JLC Type: Basic
D802 = BZT52C10T: DIODE ZENER 10V 100MW SOD523; Manufacturer: Micro Commercial Co; Manufacturer Part Number 1: BZT52C10T-TP; Part Number: BZT52C10T; Package: SC-79, SOD-523; Value: BZT52C10T; Absolute Value: 10 V; HelpURL: https://www.mccsemi.com/pdf/Products/BZT52C(B)2V4T-BZT52C(B)39T(SOD-523).pdf; Manufacturer 1: Micro Commercial Co; Supplier 1: Digi-Key; Supplier Part Number 1: 353-BZT52C10T-TPCT-ND; Manufacturer 2: Diodes Incorporated; Manufacturer Part Number 2: BZT52C10T-7; Supplier 2: Digi-Key; Supplier Part Number 2: BZT52C10T-7DICT-ND
J800 = Microfit_3.0_1x2_VERT_THT: as J601 on sheet Interfaces; Part Number: Microfit_3.0_1x2_VERT_THT; HelpURL: https://tools.molex.com/pdm_docs/ps/PS-43045.pdf; Manufacturer Part Number 1: 430450212; Supplier 1: Digi-Key; Supplier Part Number 1: WM1789-ND
J801 J802 = Solder_Jumper_3pin_0.2mm: Solder jumper with three pins with a spacing of 0.2mm; Manufacturer: NONE; Part Number: Solder_Jumper_3pin_0.2mm
Q800 = MCG35P04-TP: 40V 35A P-Channel MOSFET; Manufacturer: Micro Commercial Co; Manufacturer Part Number 1: 353-MCG35P04-TPCT-ND; Part Number: MCG35P04-TP; HelpURL: https://www.mccsemi.com/pdf/Products/MCG35P04(DFN3333).pdf; Manufacturer 1: Micro Commercial Co; Supplier 1: Digi-Key; Supplier Part Number 1: 353-MCG35P04-TPCT-ND
Q801 Q802 = AS2302: as Q600 on sheet Interfaces; Part Number: AS2302; Package: SOT23; HelpURL: https://datasheet.lcsc.com/lcsc/1809211431_AnBon-AS2302_C232266.pdf; Manufacturer Part Number 1: AS2302; Supplier 1: Digi-Key; Supplier Part Number 1: 4530-AS2302CT-ND; Manufacturer 3: AnBon; Manufacturer Part Number 3: AS2302; Supplier 3: LCSC; Supplier Part Number 3: C232266; JLC Type: Extended
R800 = 0R025/2512: RES SM 2512 0R025; Manufacturer: GENERIC; Manufacturer 1: Ohmite; Manufacturer Part Number 1: MCS3264R025FER; Absolute Value: 0.025; Part Number: 0R025/2512; Package: 2512; Value: 0R025; HelpURL: https://www.ohmite.com/assets/docs/res_mcs.pdf?r=false; Supplier 1: Digi-Key; Supplier Part Number 1: MCS3264R025FERCT-ND
R801-R807 = 100K/0603: RES SM 0603 100K; Manufacturer: GENERIC; Manufacturer 1: YAGEO; Manufacturer Part Number 1: RC0603FR-13100KL; Absolute Value: 100000; Eurocircuits GPN: GPR0603100K; Part Number: 100K/0603; Package: 0603; Value: 100K; HelpURL: https://www.yageo.com/upload/media/product/productsearch/datasheet/rchip/PYu-RC_Group_51_RoHS_L_12.pdf; Supplier 1: Digi-Key; Supplier Part Number 1: 13-RC0603FR-13100KLCT-ND; Manufacturer 2: YAGEO; Manufacturer Part Number 2: RC0603FR-10100KL; Supplier 2: Digi-Key; Supplier Part Number 2: 13-RC0603FR-10100KLCT-ND; Manufacturer 3: UNI-ROYAL(Uniroyal Elec); Manufacturer Part Number 3: 0603WAF1003T5E; Supplier 3: LCSC; Supplier Part Number 3: C25803; JLC Type: Basic
U800 = TA75S393F,LF: 36V Single Voltage Comparator; Manufacturer: Toshiba Semiconductor and Storage; Part Number: TA75S393F,LF; Package: SOT23-5; HelpURL: https://toshiba.semicon-storage.com/info/TA75S393F_datasheet_en_20220525.pdf?did=20981&prodName=TA75S393F; Manufacturer 1: Toshiba Semiconductor and Storage; Manufacturer Part Number 1: TA75S393F,LF; Supplier 1: Digi-Key; Supplier Part Number 1: TA75S393FLFCT-ND; Manufacturer 3: TOSHIBA; Manufacturer Part Number 3: TA75S393F,LF(T; Supplier 3: LCSC; Supplier Part Number 3: C840438
U801 = INA232BIDDFR: INA232 48-V, 16-Bit, Current, Voltage, and Power Monitor With an I2C Interface; Manufacturer: Texas Instruments; Part Number: INA232BIDDFR; Package: SOT23-8; HelpURL: https://www.ti.com/lit/ds/symlink/ina232.pdf; Manufacturer 1: Texas Instruments; Manufacturer Part Number 1: INA232BIDDFR; Supplier 1: Digi-Key; Supplier Part Number 1: 296-INA232BIDDFRCT-ND

## Nets that join several sheets
48V: PoE_Injector (11 pins), Ethernet Channel 1 (J502_Ethernet_Channel_1.1 J504_Ethernet_Channel_1.1 R500_Ethernet_Channel_1.2), Ethernet Channel 2 (J502_Ethernet_Channel_2.1 J504_Ethernet_Channel_2.1 R500_Ethernet_Channel_2.2), Ethernet Channel 3 (J502_Ethernet_Channel_3.1 J504_Ethernet_Channel_3.1 R500_Ethernet_Channel_3.2), Ethernet Channel 4 (J502_Ethernet_Channel_4.1 J504_Ethernet_Channel_4.1 R500_Ethernet_Channel_4.2)
+5V: Interfaces (J600.2 J600.4), RPI_Supply (7 pins), ON_OFF_Controller (C801.1 J801.3 U801.4)
+24V: DC_DC_Converter (C300.1 L300.1 R304.1), Interfaces (J602.1 J604.1), RPI_Supply (6 pins), ON_OFF_Controller (R800.2 U801.2)
+48V: DC_DC_Converter (7 pins), Interfaces (J601.1 J603.1)
GND: Charger Lower (32 pins), DC_DC_Converter (21 pins), PoE_Injector (19 pins), Mains (J100.PE J103.1 U101.4), Ethernet Channel 1 (C508_Ethernet_Channel_1.2 C509_Ethernet_Channel_1.2 J500_Ethernet_Channel_1.9 J501_Ethernet_Channel_1.9), Ethernet Channel 2 (C508_Ethernet_Channel_2.2 C509_Ethernet_Channel_2.2 J500_Ethernet_Channel_2.9 J501_Ethernet_Channel_2.9), Ethernet Channel 3 (C508_Ethernet_Channel_3.2 C509_Ethernet_Channel_3.2 J500_Ethernet_Channel_3.9 J501_Ethernet_Channel_3.9), Ethernet Channel 4 (C508_Ethernet_Channel_4.2 C509_Ethernet_Channel_4.2 J500_Ethernet_Channel_4.9 J501_Ethernet_Channel_4.9), Interfaces (21 pins), RPI_Supply (10 pins), ON_OFF_Controller (12 pins)
GND_BAT: Charger Upper (32 pins), Charger Lower (10 pins), Mains (U100.4)
I2C.SCL: PoE_Injector (U400.9), Interfaces (C601.1 D601.1 R603.1), ON_OFF_Controller (J802.3 U801.5)
I2C.SDA: PoE_Injector (U400.10 U400.11), Interfaces (C600.1 D600.1 R602.1), ON_OFF_Controller (J802.1 U801.6)
NetC200_Charger_Upper_1: Charger Upper (10 pins), ON_OFF_Controller (C800.1 J800.1 Q800.S R801.1)
NetC402_2: PoE_Injector (C402.2 D400.2 Q400.3 U400.2), Ethernet Channel 1 (D500_Ethernet_Channel_1.1 J503_Ethernet_Channel_1.1 J505_Ethernet_Channel_1.1)
NetC403_2: PoE_Injector (C403.2 D401.2 Q401.3 U400.31), Ethernet Channel 2 (D500_Ethernet_Channel_2.1 J503_Ethernet_Channel_2.1 J505_Ethernet_Channel_2.1)
NetC405_2: PoE_Injector (C405.2 D402.2 Q402.3 U400.28), Ethernet Channel 3 (D500_Ethernet_Channel_3.1 J503_Ethernet_Channel_3.1 J505_Ethernet_Channel_3.1)
NetC406_2: PoE_Injector (C406.2 D403.2 Q403.3 U400.25), Ethernet Channel 4 (D500_Ethernet_Channel_4.1 J503_Ethernet_Channel_4.1 J505_Ethernet_Channel_4.1)
NetC604_1: Interfaces (C604.1 R604.1), ON_OFF_Controller (R807.1)
NetD800_2: Interfaces (R606.1), ON_OFF_Controller (D800.2 J800.2)
NetQ200_Charger_Lower_D: Charger Lower (Q200_Charger_Lower.D R207_Charger_Lower.1), Mains (U101.3)
NetQ200_Charger_Upper_D: Charger Upper (Q200_Charger_Upper.D R207_Charger_Upper.1), Mains (U100.3)